# Altium schematic sheet ESC_MCU.SchDoc
size B; DocumentNumber: 3; SheetNumber: 5; SheetTotal: 7
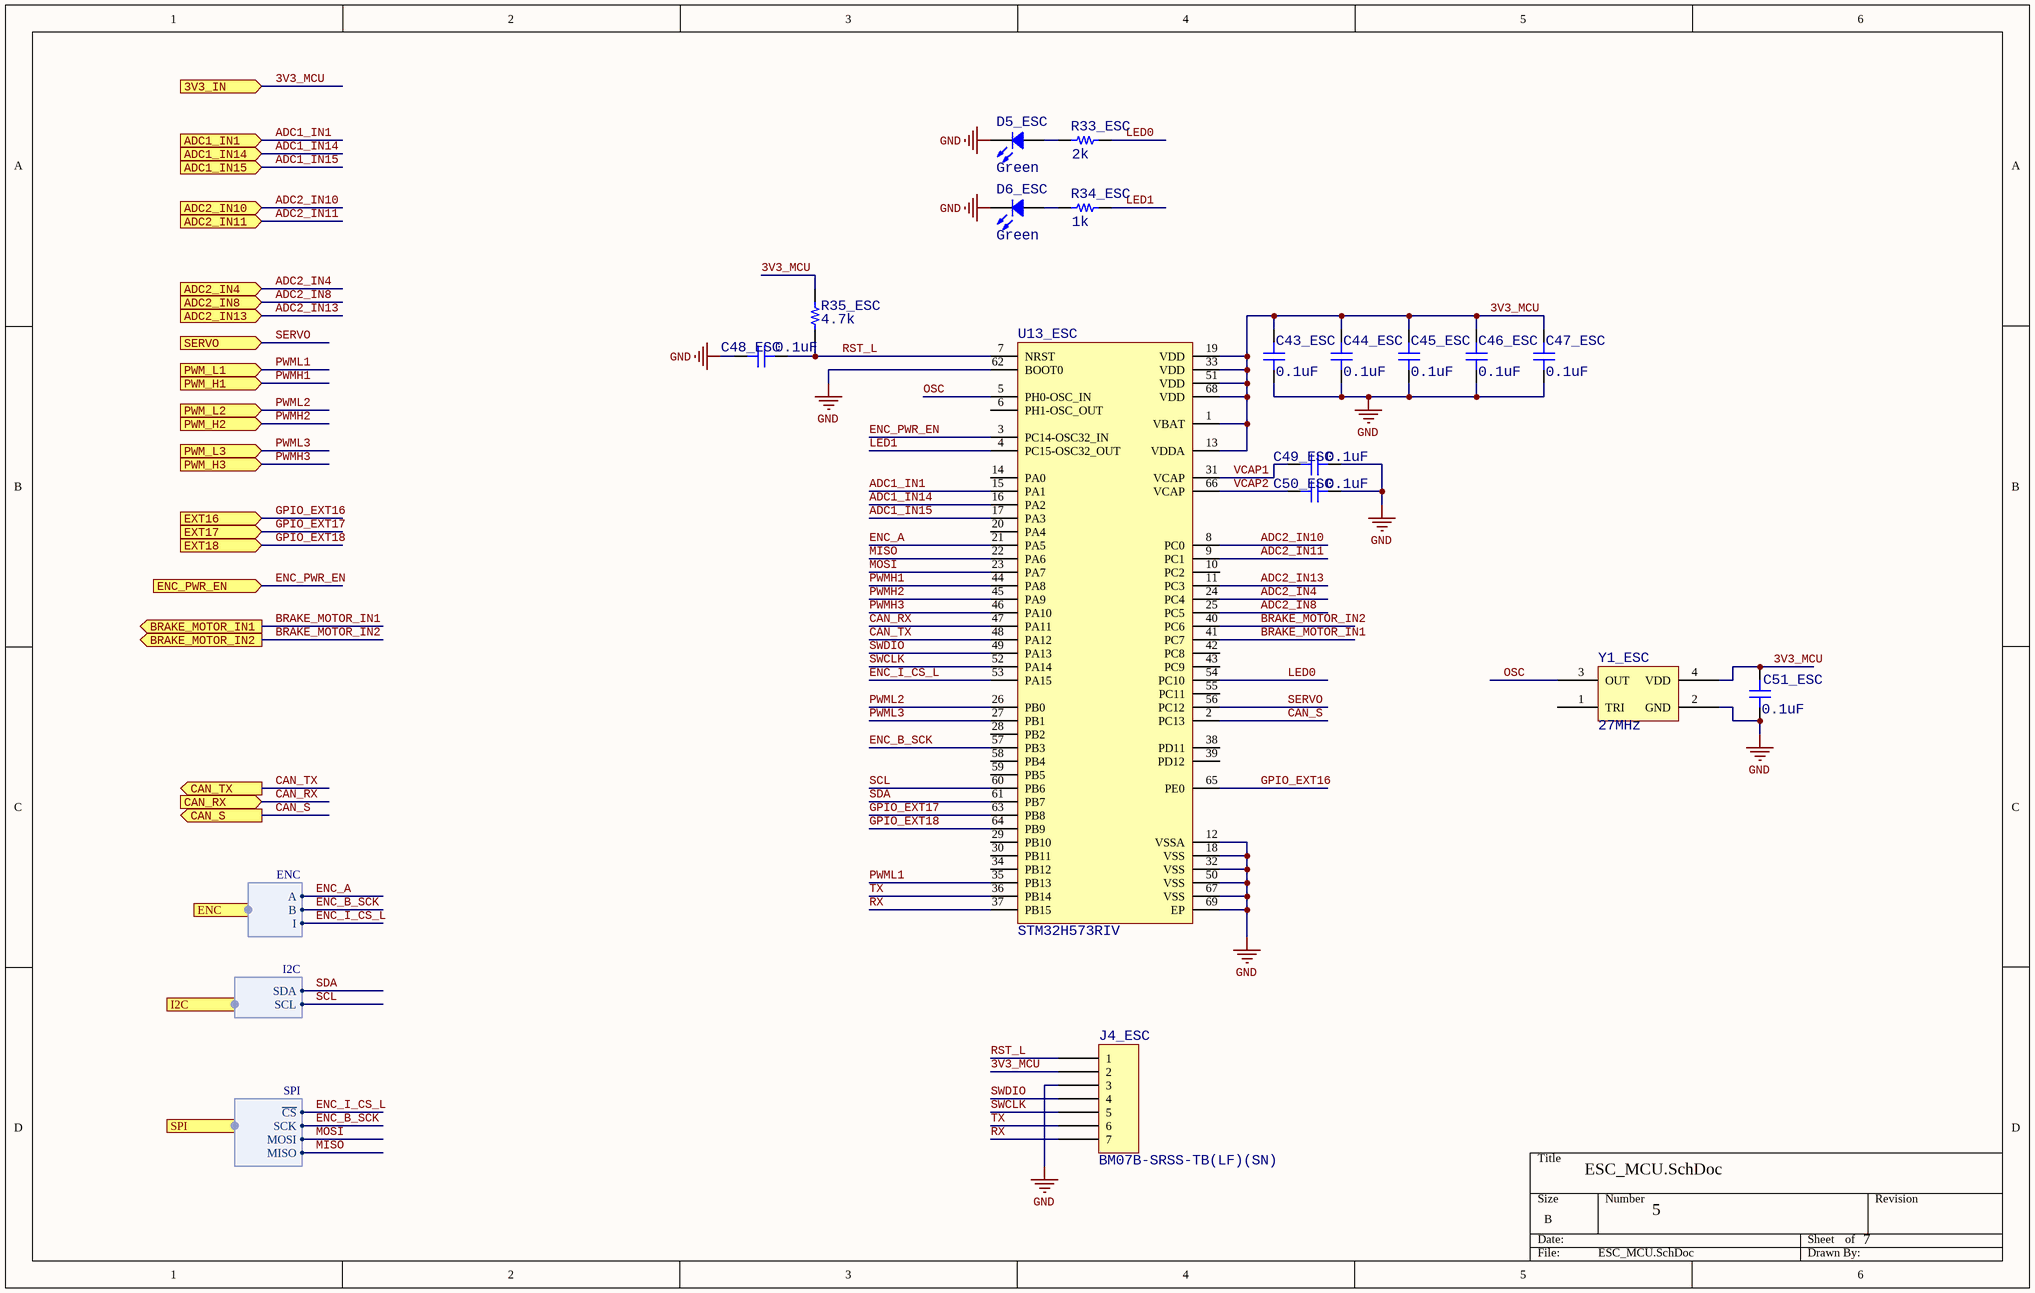
[diagram p0: ESC_MCU.SchDoc]

## Parts
C43_ESC  0.1uF  [CAP_0402]
C44_ESC  0.1uF  [CAP_0402]
C45_ESC  0.1uF  [CAP_0402]
C46_ESC  0.1uF  [CAP_0402]
C47_ESC  0.1uF  [CAP_0402]
C48_ESC  0.1uF  [CAP_0402]
C49_ESC  0.1uF  [CAP_0402]
C50_ESC  0.1uF  [CAP_0402]
C51_ESC  0.1uF  [CAP_0402]
D5_ESC  Green  [LED 0603_1608 GREEN]
D6_ESC  Green  [LED 0603_1608 GREEN]
J4_ESC  BM07B-SRSS-TB(LF)(SN)  [JST BM07B-SRSS-TB]
R33_ESC  2k  [RES_0402]
R34_ESC  1k  [RES_0402]
R35_ESC  4.7k  [RES_0402]
U13_ESC  STM32H573RIV  [68-VFQFPN]
Y1_ESC  27MHz  [ABRACON ASD]

## Ports
3V3_IN (in), ADC1_IN1 (in), ADC1_IN14 (in), ADC1_IN15 (in), ADC2_IN4 (in), ADC2_IN8 (in), ADC2_IN10 (in), ADC2_IN11 (in), ADC2_IN13 (in), BRAKE_MOTOR_IN1 (out), BRAKE_MOTOR_IN2 (out), CAN_RX (in), CAN_S (out), CAN_TX (out), ENC (harness ENC), ENC_PWR_EN (in), EXT16 (in), EXT17 (in), EXT18 (in), I2C (harness I2C), PWM_H1 (in), PWM_H2 (in), PWM_H3 (in), PWM_L1 (in), PWM_L2 (in), PWM_L3 (in), SERVO (in), SPI (harness SPI)

## Harnesses
I2C: SDA, SCL
ENC: A, B, I
SPI: ~{CS}, SCK, MOSI, MISO

## Nets
GND: C43_ESC.1 C44_ESC.1 C45_ESC.1 C46_ESC.1 C47_ESC.1 C48_ESC.2 C49_ESC.1 C50_ESC.1 C51_ESC.1 D5_ESC.2 D6_ESC.2 J4_ESC.3 U13_ESC.12(VSSA) U13_ESC.18(VSS) U13_ESC.32(VSS) U13_ESC.50(VSS) U13_ESC.62(BOOT0) U13_ESC.67(VSS) U13_ESC.69(EP) Y1_ESC.2(GND)
3V3_MCU: C43_ESC.2 C44_ESC.2 C45_ESC.2 C46_ESC.2 C47_ESC.2 C51_ESC.2 J4_ESC.2 R35_ESC.2 U13_ESC.1(VBAT) U13_ESC.13(VDDA) U13_ESC.19(VDD) U13_ESC.33(VDD) U13_ESC.51(VDD) U13_ESC.68(VDD) Y1_ESC.4(VDD) ; port 3V3_IN
ADC1_IN1: U13_ESC.15(PA1) ; port ADC1_IN1
ADC1_IN14: U13_ESC.16(PA2) ; port ADC1_IN14
ADC1_IN15: U13_ESC.17(PA3) ; port ADC1_IN15
ADC2_IN4: U13_ESC.24(PC4) ; port ADC2_IN4
ADC2_IN8: U13_ESC.25(PC5) ; port ADC2_IN8
ADC2_IN10: U13_ESC.8(PC0) ; port ADC2_IN10
ADC2_IN11: U13_ESC.9(PC1) ; port ADC2_IN11
ADC2_IN13: U13_ESC.11(PC3) ; port ADC2_IN13
BRAKE_MOTOR_IN1: U13_ESC.41(PC7) ; port BRAKE_MOTOR_IN1
BRAKE_MOTOR_IN2: U13_ESC.40(PC6) ; port BRAKE_MOTOR_IN2
CAN_RX: U13_ESC.47(PA11) ; port CAN_RX
CAN_S: U13_ESC.2(PC13) ; port CAN_S
CAN_TX: U13_ESC.48(PA12) ; port CAN_TX
ENC_A: U13_ESC.21(PA5) ; port ENC.A
ENC_B_SCK: U13_ESC.57(PB3) ; port ENC.B, port SPI.SCK
ENC_I_CS_L: U13_ESC.53(PA15) ; port ENC.I, port SPI.~{CS}
ENC_PWR_EN: U13_ESC.3(PC14-OSC32_IN) ; port ENC_PWR_EN
GPIO_EXT16: U13_ESC.65(PE0) ; port EXT16
GPIO_EXT17: U13_ESC.63(PB8) ; port EXT17
GPIO_EXT18: U13_ESC.64(PB9) ; port EXT18
LED0: R33_ESC.2 U13_ESC.54(PC10)
LED1: R34_ESC.2 U13_ESC.4(PC15-OSC32_OUT)
MISO: U13_ESC.22(PA6) ; port SPI.MISO
MOSI: U13_ESC.23(PA7) ; port SPI.MOSI
OSC: U13_ESC.5(PH0-OSC_IN) Y1_ESC.3(OUT)
PWMH1: U13_ESC.44(PA8) ; port PWM_H1
PWMH2: U13_ESC.45(PA9) ; port PWM_H2
PWMH3: U13_ESC.46(PA10) ; port PWM_H3
PWML1: U13_ESC.35(PB13) ; port PWM_L1
PWML2: U13_ESC.26(PB0) ; port PWM_L2
PWML3: U13_ESC.27(PB1) ; port PWM_L3
RST_L: C48_ESC.1 J4_ESC.1 R35_ESC.1 U13_ESC.7(NRST)
RX: J4_ESC.7 U13_ESC.37(PB15)
SCL: U13_ESC.60(PB6) ; port I2C.SCL
SDA: U13_ESC.61(PB7) ; port I2C.SDA
SERVO: U13_ESC.56(PC12) ; port SERVO
SWCLK: J4_ESC.5 U13_ESC.52(PA14)
SWDIO: J4_ESC.4 U13_ESC.49(PA13)
TX: J4_ESC.6 U13_ESC.36(PB14)
VCAP1: C49_ESC.2 U13_ESC.31(VCAP)
VCAP2: C50_ESC.2 U13_ESC.66(VCAP)
NetD5_ESC_1: D5_ESC.1 R33_ESC.1
NetD6_ESC_1: D6_ESC.1 R34_ESC.1

Not connected (* = marked no-connect by the designer): U13_ESC 6(PH1-OSC_OUT) 10(PC2) 14(PA0) 20(PA4) 28(PB2) 29(PB10) 30(PB11) 34(PB12) 38(PD11) 39(PD12) 42(PC8) 43(PC9) 55(PC11) 58(PB4) 59(PB5); Y1_ESC 1(TRI)

## Library data of the parts
C43_ESC C44_ESC C45_ESC C46_ESC C47_ESC C48_ESC C49_ESC C50_ESC C51_ESC = CAP_0402: CAP CER 402; Value: 0.1uF
D5_ESC D6_ESC = XZCDGK53W-8VF: LED GREEN CLEAR 2SMD; Manufacturer: SunLED; Configuration: Independent; Current - Test: 2mA; Lens Color: Colorless; Lens Size: 0.35mm Dia; Lens Style: Round with Domed Top; Millicandela Rating: 417mcd; Viewing Angle: 60°; Voltage - Forward (Vf) (Typ): 2.65V; Wavelength - Dominant: 525nm; Wavelength - Peak: 515nm; Part Number: XZCDGK53W-8VF; Color: Green; ComponentLink1Description: Datasheet; ComponentLink1URL: https://www.sunledusa.com/products/spec/XZCDGK53W-8VF.pdf; ComponentLink2Description: DigiKey Link; ComponentLink2URL: https://www.digikey.com/en/products/detail/sunled/XZCDGK53W-8VF/10449775; Device Package: 0603 (1608 Metric); Height (Max): 1.10mm; LastUpdated: 6/3/2024 7:58:52 PM; Lens Transparency: Clear; Lifecycle Status: Active; Minimum Order: 1; Mounting Type: Surface Mount; Package / Case: 0603 (1608 Metric); Packaging: TapeAndReel; PartId: 938; Part Status: Active; Price: 0.15; Series: Ultra Low Current; Size / Dimension: 1.60mm L x 0.80mm W; Supplier 1: DigiKey; Supplier Part Number 1: 1497-XZCDGK53W-8VFCT-ND; Supplier Device Package: 2-SMD; Value: Green
J4_ESC = BM07B-SRSS-TB(LF)(SN): CONN HEADER SMD 7POS 1MM; Manufacturer: JST Sales America Inc.; Current Rating (Amps): 0.7A; Material Flammability Rating: UL94 V-0; Number of Positions: 7; Number of Positions Loaded: All; Pitch - Mating: 0.039" (1.00mm); Shrouding: Shrouded - 4 Wall; Style: Board to Cable/Wire; Voltage Rating: 50V; Part Number: BM07B-SRSS-TB(LF)(SN); ComponentLink1Description: Datasheet; ComponentLink1URL: http://www.jst-mfg.com/product/pdf/eng/eSH.pdf; ComponentLink2Description: DigiKey Link; ComponentLink2URL: http://digikey.com/product-detail/en/jst-sales-america-inc/BM07B-SRSS-TB-LF-SN/455-1793-1-ND/926864; Connector Type: Header; Contact Finish - Mating: Tin; Contact Finish - Post: Tin; Contact Material: Copper Alloy; Contact Shape: Square; Contact Type: Male Pin; Fastening Type: Push-Pull; Features: Solder Retention; Insulation Color: Natural; Insulation Height: 0.167" (4.25mm); Insulation Material: Polyamide (PA), Nylon; LastUpdated: 1/12/2020 10:15:04 PM; Lifecycle Status: Active; Minimum Order: 1; Mounting Type: Surface Mount; Number of Rows: 1; Operating Temperature: -25°C ~ 85°C; Packaging: TapeAndReel; PartId: 22; Part Status: Active; Price: 0.42; Series: SR; Supplier 1: DigiKey; Supplier Part Number 1: 455-1793-1-ND; Termination: Solder
R33_ESC R34_ESC R35_ESC = RES_0402: RES 0402
Y1_ESC = ASD3-27.000MHZ-EC-T: XTAL OSC XO 27.0000MHZ HCMOS SMD; Manufacturer: Abracon LLC; Base Resonator: Crystal; Current - Supply (Max): 4mA; Frequency Stability: ±50ppm; Function: Enable/Disable; Voltage - Supply: 1.8V; Part Number: ASD3-27.000MHZ-EC-T; ComponentLink1Description: Datasheet; ComponentLink1URL: https://abracon.com/Oscillators/ASDseries.pdf; ComponentLink2Description: DigiKey Link; ComponentLink2URL: http://digikey.com/product-detail/en/abracon-llc/ASD3-27.000MHZ-EC-T/535-9608-1-ND/1237075; Frequency: 27MHz; Height - Seated (Max): 0.039" (1.00mm); LastUpdated: 6/3/2024 8:02:05 PM; Lifecycle Status: Active; Minimum Order: 1; Mounting Type: Surface Mount; Operating Temperature: -20°C ~ 70°C; Output: HCMOS; Package / Case: 4-SMD, No Lead; Packaging: TapeAndReel; PartId: 4; Part Status: Active; Price: 1.74; Series: ASD; Size / Dimension: 0.098" L x 0.079" W (2.50mm x 2.00mm); Supplier 1: DigiKey; Supplier Part Number 1: 535-9608-1-ND; Type: XO (Standard); Value: 27MHz